# EAGLE design ECG_max86150_v1.7 (EAGLE 9.5.2)
ECG
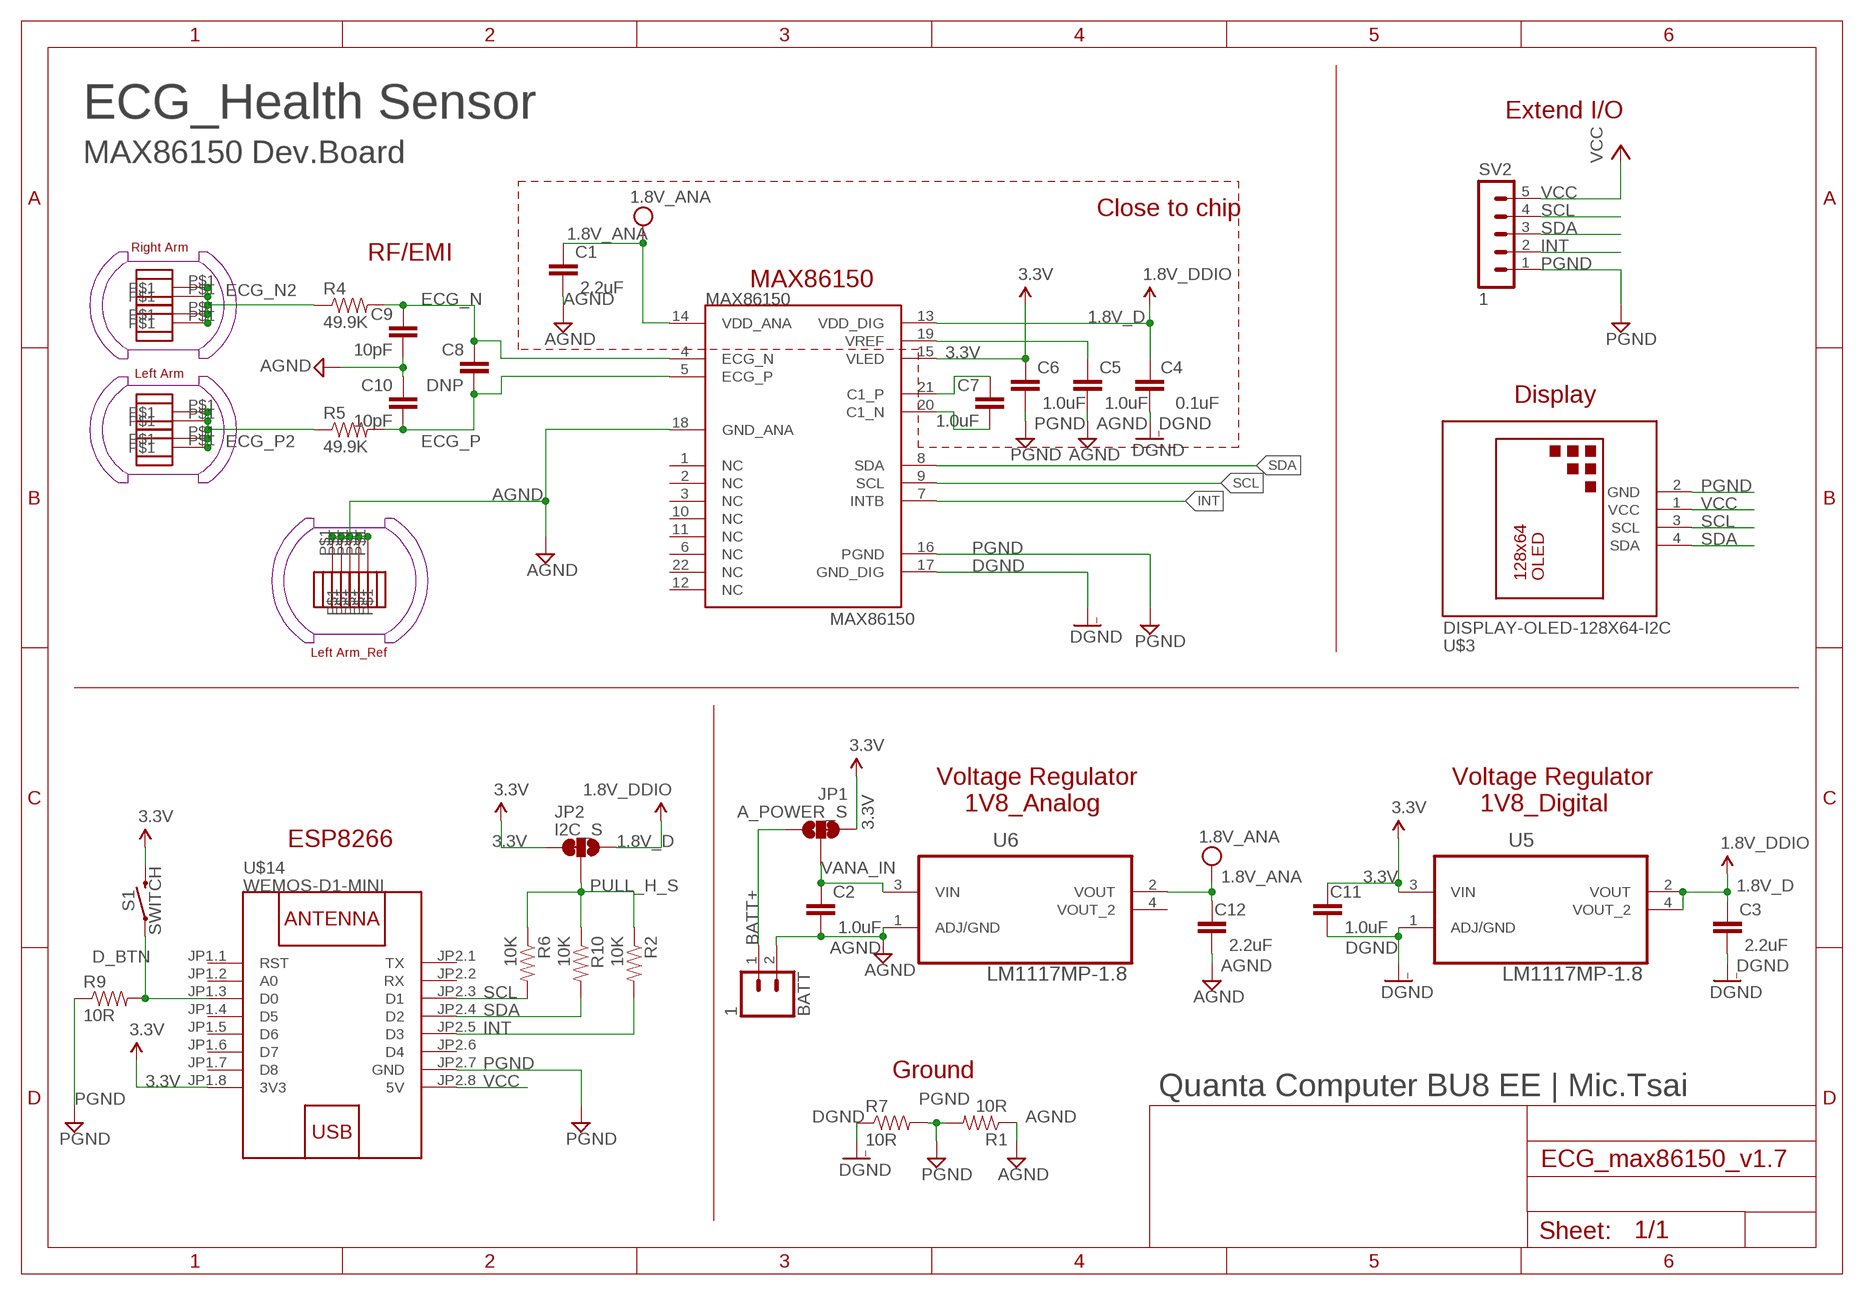
[diagram p0: schematic, sheet 1]

## Parts
BATT  1  CONN_02  [1X02]
C1  2.2uF  1.0UF-0805-25V-10%  [0805]
C2  1.0uF  1.0UF-0805-25V-10%  [0805]
C3  2.2uF  1.0UF-0805-25V-10%  [0805]
C4  0.1uF  1.0UF-0402-16V-10%  [0402]
C5  1.0uF  1.0UF-0805-25V-10%  [0805]
C6  1.0uF  1.0UF-0805-25V-10%  [0805]
C7  1.0uF  1.0UF-0805-25V-10%  [0805]
C8  DNP  1.0UF-0402-16V-10%  [0402]
C9  10pF  1.0UF-0402-16V-10%  [0402]
C10  10pF  1.0UF-0402-16V-10%  [0402]
C11  1.0uF  1.0UF-0805-25V-10%  [0805]
C12  2.2uF  1.0UF-0805-25V-10%  [0805]
JP1  A_POWER_S  JUMPER-SMT_3_1-NC_TRACE_SILK  [SMT-JUMPER_3_1-NC_TRACE_SILK]
JP2  I2C_S  JUMPER-SMT_3_1-NC_TRACE_SILK  [SMT-JUMPER_3_1-NC_TRACE_SILK]
MAX86150  MAX86150  [MAX86150]
R1  10R  RESISTOR0805-RES  [0805]
R2  10K  RESISTOR0402-RES  [0402-RES]
R4  49.9K  RESISTOR0402-RES  [0402-RES]
R5  49.9K  RESISTOR0402-RES  [0402-RES]
R6  10K  RESISTOR0402-RES  [0402-RES]
R7  10R  RESISTOR0805-RES  [0805]
R9  10R  RESISTOR0805-RES  [0805]
R10  10K  RESISTOR0402-RES  [0402-RES]
S1  SWITCH  MOMENTARY-SWITCH-SPST-PTH-6.0MM  [TACTILE_SWITCH_PTH_6.0MM]
SV2  1  MA05-1  [MA05-1]
U5  LM1117MP-1.8  [SOT230P696X180-4N]
U6  LM1117MP-1.8  [SOT230P696X180-4N]
U$1  ECG_PAD  [ECG_PAD1]
U$3  DISPLAY-OLED-128X64-I2C  [DISPLAY-OLED-128X64-I2C]
U$4  ECG_PAD  [ECG_PAD1]
U$6  ECG_PAD  [ECG_PAD1]
U$7  ECG_PAD  [ECG_PAD1]
U$9  ECG_PAD  [ECG_PAD1]
U$10  ECG_PAD  [ECG_PAD1]
U$11  ECG_PAD  [ECG_PAD1]
U$12  ECG_PAD  [ECG_PAD1]
U$13  ECG_PAD  [ECG_PAD1]
U$14  WEMOS-D1-MINI  [WEMOS-D1-MINI]
U$15  ECG_PAD  [ECG_PAD1]
U$16  ECG_PAD  [ECG_PAD1]
U$17  ECG_PAD  [ECG_PAD1]
U$18  ECG_PAD  [ECG_PAD1]

## Nets
1.8V_ANA: C1.1 C12.1 MAX86150.14(VDD_ANA) U6.2(VOUT)
1.8V_D: C3.1 C4.1 JP2.1 MAX86150.13(VDD_DIG) U5.2(VOUT) U5.4(VOUT_2) ; supply symbol labelled 1.8V_DDIO
3.3V: C6.1 C11.1 JP1.3 JP2.3 MAX86150.15(VLED) S1.3 U5.3(VIN) U$14.JP1.8(3V3)
AGND: BATT.2 C1.2 C2.2 C5.2 C9.2 C10.1 C12.2 MAX86150.18(GND_ANA) R1.1 U6.1(ADJ/GND) U$12.P$1 U$13.P$1 U$15.P$1 U$17.P$1 U$18.P$1
BATT+: BATT.1 JP1.1
D_BTN: R9.2 S1.1 U$14.JP1.3(D0)
DGND: C3.2 C4.2 C11.2 MAX86150.17(GND_DIG) R7.1 U5.1(ADJ/GND)
ECG_N: C8.1 C9.1 MAX86150.4(ECG_N) R4.2
ECG_N2: R4.1 U$9.P$1 U$10.P$1 U$11.P$1 U$16.P$1
ECG_P: C8.2 C10.2 MAX86150.5(ECG_P) R5.2
ECG_P2: R5.1 U$1.P$1 U$4.P$1 U$6.P$1 U$7.P$1
INT: MAX86150.7(INTB) R2.2 SV2.2 U$14.JP2.5(D3)
N$1: C7.1 MAX86150.21(C1_P)
N$2: C7.2 MAX86150.20(C1_N)
N$4: C5.1 MAX86150.19(VREF)
PGND: C6.2 MAX86150.16(PGND) R1.2 R7.2 R9.1 SV2.1 U$3.2(GND) U$14.JP2.7(GND)
PULL_H_S: JP2.2 R2.1 R6.1 R10.1
SCL: MAX86150.9(SCL) R6.2 SV2.4 U$3.3(SCL) U$14.JP2.3(D1)
SDA: MAX86150.8(SDA) R10.2 SV2.3 U$3.4(SDA) U$14.JP2.4(D2)
VANA_IN: C2.1 JP1.2 U6.3(VIN)
VCC: SV2.5 U$3.1(VCC) U$14.JP2.8(5V)
Unconnected: MAX86150.1(NC) MAX86150.2(NC) MAX86150.3(NC) MAX86150.6(NC) MAX86150.10(NC) MAX86150.11(NC) MAX86150.12(NC) MAX86150.22(NC) U6.4(VOUT_2) U$14.JP1.1(RST) U$14.JP1.2(A0) U$14.JP1.4(D5) U$14.JP1.5(D6) U$14.JP1.6(D7) U$14.JP1.7(D8) U$14.JP2.1(TX) U$14.JP2.2(RX) U$14.JP2.6(D4)

## Notes on the sheet
- ECG_Health Sensor | Extend I/O
- MAX86150 Dev.Board
- Close to chip
- Right Arm
- RF/EMI
- MAX86150
- Left Arm
- Display
- Left Arm_Ref
- Voltage Regulator
      1V8_Analog
- Voltage Regulator
      1V8_Digital
- ESP8266
- Ground
- Quanta Computer BU8 EE | Mic.Tsai

## Library data of the parts
BATT = SparkFun-Connectors:CONN_02: Multi connection point. Often used as Generic Header-pin footprint for 0.1 inch spaced/style header connections On any of the 0.1 inch spaced packages, you can populate with these: Break Away Headers - Straight <https://www.sparkfun.com/products/116> (PRT-00116) Break Away Male Headers - Right Angle <https://www.sparkfun.com/products/553> (PRT-00553) Female Headers <https://www.sparkfun.com/products/115> (PRT-00115) Break Away Headers - Machine Pin <https://www.sparkfun.com/products/117> (PRT-00117) Break Away Female Headers - Swiss Machine Pin <https://www.sparkfun.com/products/743> (PRT-00743) For SCREWTERMINALS and SPRING TERMINALS visit here: Screw Terimnals on SparkFun.com <https://www.sparkfun.com/search/results?term=Screw+Terminals> (5mm/3.5mm/2.54mm spacing) This device is also useful as a general connection point to wire up your design to another part of your project. Our various solder wires solder well into these plated through hole pads. Hook-Up Wire - Assortment (Stranded, 22 AWG) <https://www.sparkfun.com/products/11375> (PRT-11375) Hook-Up Wire - Assortment (Solid Core, 22 AWG) <https://www.sparkfun.com/products/11367> (PRT-11367) View the entire wire category on our website here <https://www.sparkfun.com/categories/141> Special notes: Molex polarized connector foot print use with: PRT-08233 with associated crimp pins and housings. 2.54_SCREWTERM for use with PRT-10571. 3.5mm Screw Terminal footprints for PRT-08084 5mm Screw Terminal footprints for use with PRT-08432
C1 C3 C12 = SparkFun-Capacitors:1.0UF: 1µF ceramic capacitors A capacitor is a passive two-terminal electrical component used to store electrical energy temporarily in an electric field.; PROD_ID: CAP-08064; VALUE: 1.0uF
C2 C5-C7 C11 = SparkFun-Capacitors:1.0UF: 1µF ceramic capacitors A capacitor is a passive two-terminal electrical component used to store electrical energy temporarily in an electric field.; PROD_ID: CAP-08064
C4 C8-C10 = SparkFun-Capacitors:1.0UF: 1µF ceramic capacitors A capacitor is a passive two-terminal electrical component used to store electrical energy temporarily in an electric field.; PROD_ID: CAP-12417; VALUE: 1.0uF
JP1 JP2 = SparkFun-Jumpers_change:JUMPER-SMT_3_1-NC_TRACE: Normally closed trace jumper (1 of 2 connections) This jumper has a trace between two pads so it's normally closed (NC). The other connection is normally open (NO). Use a razor knife to open the connection. For best results follow the IPC guidelines for cutting traces: Cutout at least 0.063 mm (0.005 in). Remove all loose material to clean up the cut area. Seal the cut with an approved epoxy. Reapply solder to reclose the connection, or to close the NO connection.
MAX86150 = circuitects:MAX86150
R1 R2 R4-R7 R9 R10 = SparkFun:RESISTOR: Resistor Basic schematic elements and footprints for 0603, 1206, and PTH resistors.
S1 = SparkFun-Switches:MOMENTARY-SWITCH-SPST: Momentary Switch (Pushbutton) - SPST Normally-open (NO) SPST momentary switches (buttons, pushbuttons). Variants PTH-12MM - 12mm square, through-hole Momentary Pushbutton Switch - 12mm Square <https://www.sparkfun.com/products/9190> (COM-09190) PTH-6.0MM, PTH-6.0MM-KIT - 6.0mm square, through-hole Mini Pushbutton Switch <https://www.sparkfun.com/products/97> (COM-00097) KIT package intended for soldering kit's - only one side of pads' copper is exposed. PTH-RIGHT-ANGLE-KIT - Right-angle, through-hole Right Angle Tactile Button <https://www.sparkfun.com/products/10791> - Used on SparkFun BigTime Watch Kit <https://www.sparkfun.com/products/11734> SMD-12MM - 12mm square, surface-mount Tactile Button - SMD (12mm) <https://www.sparkfun.com/products/12993> (COM-12993) Used on SparkFun PicoBoard <https://www.sparkfun.com/products/11888> SMD-4.5MM - 4.5mm Square Trackball Switch Used on SparkFun Blackberry Trackballer Breakout <https://www.sparkfun.com/products/13169> SMD-4.6MMX2.8MM - 4.60mm x 2.80mm, surface mount Used on SparkFun SAMD21 Mini Breakout <https://www.sparkfun.com/products/13664> SMD-5.2MM, SMD-5.2-REDUNDANT - 5.2mm square, surface-mount Mini Pushbutton Switch - SMD <https://www.sparkfun.com/products/8720> (COM-08720) Used on Arduino Pro Mini <https://www.sparkfun.com/products/11114> REDUNDANT package connects both switch circuits together SMD-6.0X3.5MM - 6.0 x 3.5mm, surface mount Momentary Reset Switch SMD <https://www.sparkfun.com/products/8229> (COM-08229) SMD-6.2MM-TALL - 6.2mm square, surface mount Tactile Button - SMD (6mm) <https://www.sparkfun.com/products/12992> Used on SparkFun Digital Sandbox <https://www.sparkfun.com/products/12651> SMD-RIGHT-ANGLE - Right-angle, surface mount Used on SparkFun Block for Intel® Edison - Arduino <https://www.sparkfun.com/products/13036>; PROD_ID: SWCH-08441; SF_SKU: COM-00097
SV2 = con-lstb:MA05-1: PIN HEADER; OC_FARNELL: unknown; OC_NEWARK: unknown
U5 U6 = LM1117MP-1.8:LM1117MP-1.8: IC REG LDO 800MA 1.8V; AVAILABILITY: Unavailable; DESCRIPTION: Linear Voltage Regulator IC 1 Output 800mA SOT-223; MF: Texas Instruments; MP: LM1117MP-1.8/NOPB; PACKAGE: SOT-223 Texas Instruments; PRICE: None
U$1 U$4 U$6 U$7 U$9-U$13 U$15-U$18 = circuitects:ECG_PAD
U$3 = diy-modules_oled change:DISPLAY-OLED-128X64-I2C: 128x64 Dot Matrix OLED Module based on SSD1306 chip Variant with I2C interface More details available here: http://www.instructables.com/id/Monochrome-096-i2c-OLED-display-with-arduino-SSD13/ SSD1306 datasheet: https://cdn-shop.adafruit.com/datasheets/SSD1306.pdf Click here to find device on ebay.com <http://www.ebay.com/sch/oled+display+128x64+iic> Note: There are two variants: I2C and SPI. Search for the proper version.
U$14 = diy-modules:WEMOS-D1-MINI: WEMOS D1 mini: Mini Wi-Fi Board based on ESP-8266 device More details can be found here: https://www.wemos.cc/product/d1-mini.html Click here to find device on ebay.com <http://www.ebay.com/sch/wemos+d1+mini+nodemcu>

## Board
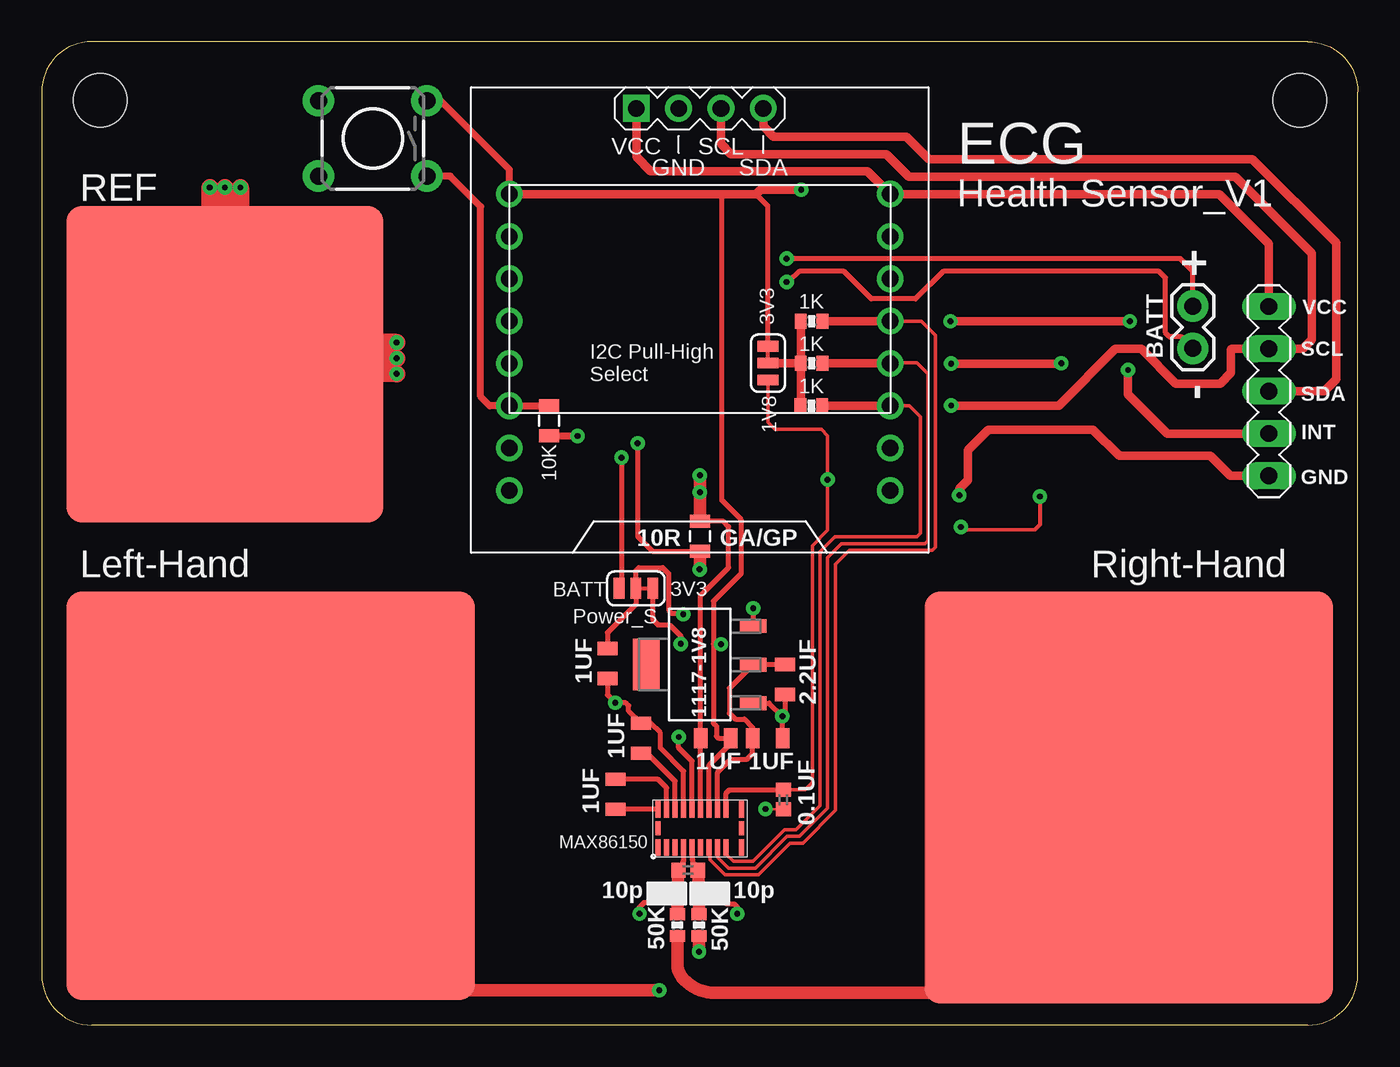
[diagram p1: board, top side]
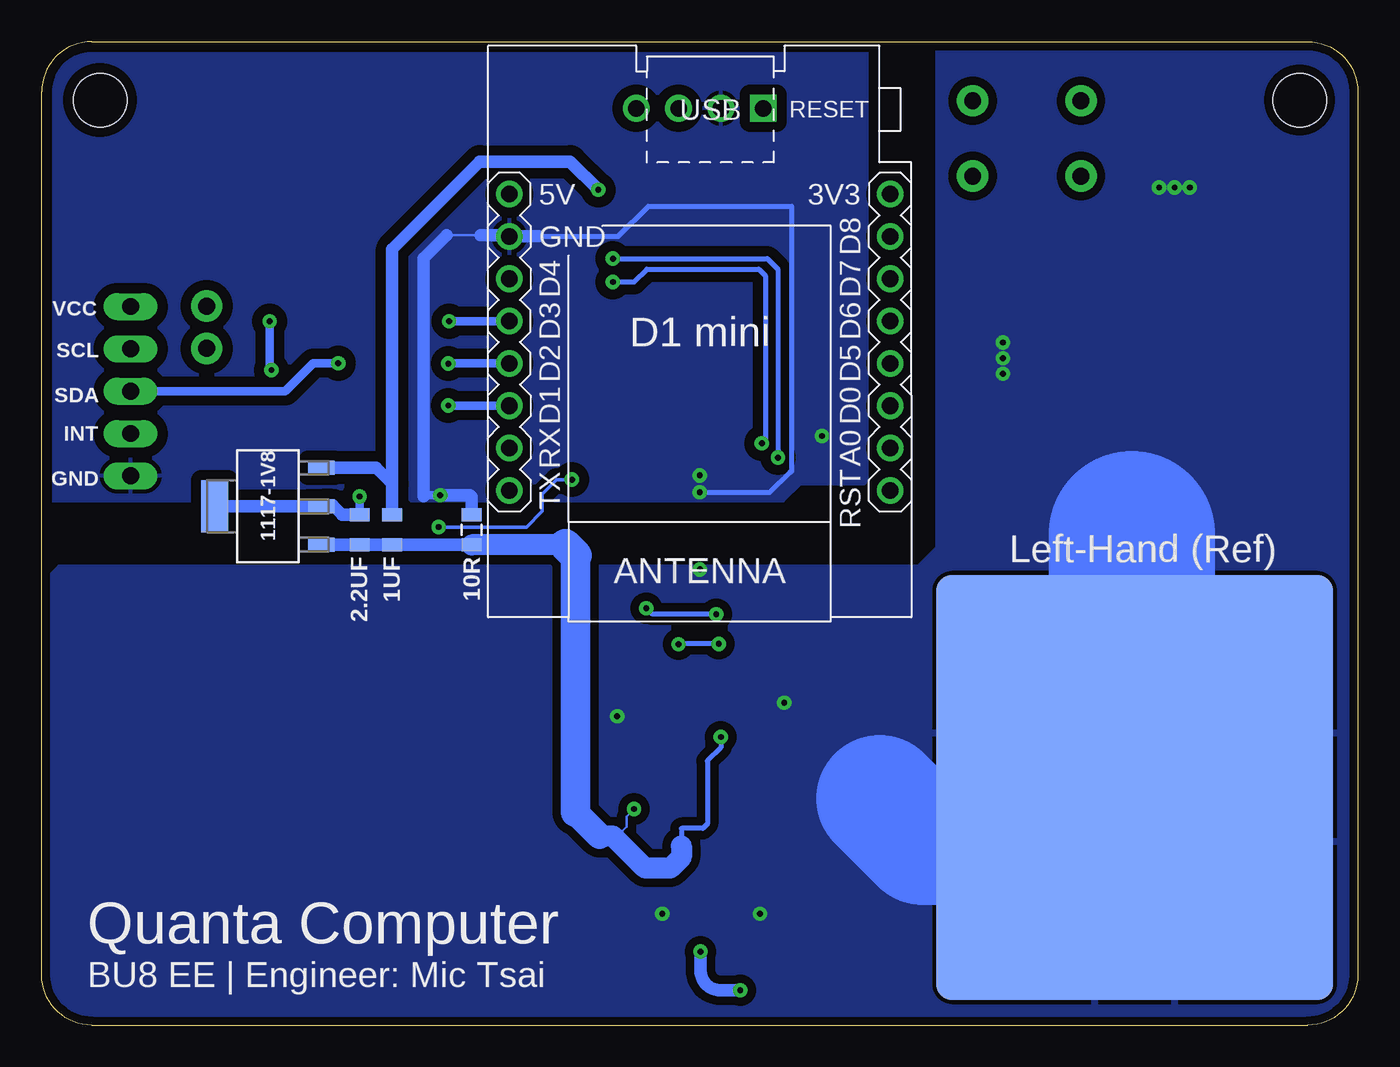
[diagram p2: board, bottom side, seen from below]

Size 79 x 59 mm. Coordinates in mm from the lower left corner, seen from the top.
Outline: 0,56 0,3 arc90 3,0 76,0 arc90 79,3 79,56 arc90 76,59 3,59 arc90 0,56
Copper layers (1*16): Top 0.035mm / dielectric 1.5mm / Bottom 0.035mm
Design rules "Circuitects-Rules *": minimum track width 6mil, minimum drill 0.3mm, track to track 8mil, track to pad 8mil, pad to pad 8mil, via to via 6mil, smd to smd 6mil, copper to edge 10mil, drill to drill 8mil, minimum pad ring 12mil, minimum via ring 10mil, stop-mask expansion 4mil, vias tented up to drill 25mil, thermal gap 10mil
Holes 3.2 mm at 3.5,55.5 75.5,55.5

### Footprints (pad centres in the part's own frame; a part is rotated, then mirrored left to right if it is on the bottom)
1X02 = drill 1.016 pad 1.88: 1 0,0; 2 2.54,0
0805 = smd 0.8 x 1.2: 1 -0.9,0; 2 0.9,0
0402 = smd 0.85 x 0.9: 1 -0.58,0; 2 0.58,0
SMT-JUMPER_3_1-NC_TRACE_SILK = smd 0.635 x 1.27: 1 -1.016,0; 2 0,0; 3 1.016,0
MAX86150 = smd 1 x 0.3: 1 -1.15,2.5; 2 -1.15,1.99; 3 -1.15,1.48; 4 -1.15,0.97; 5 -1.15,0.46; 6 -1.15,-0.05; 7 -1.15,-0.56; 8 -1.15,-1.07; 9 -1.15,-1.58; 10 -1.15,-2.5; 12 1.15,-2.5; 13 1.15,-1.58; 14 1.15,-1.07; 15 1.15,-0.56; 16 1.15,-0.05; 17 1.15,0.46; 18 1.15,0.97; 19 1.15,1.48; 20 1.15,1.99; 21 1.15,2.5 | smd 0.85 x 0.3: 11 0,-2.5; 22 0,2.5
0402-RES = smd 0.7 x 0.9: 1 -0.65,0; 2 0.65,0
TACTILE_SWITCH_PTH_6.0MM = drill 1.016 pad 1.88: 1 -3.251,2.261; 2 3.251,2.261; 3 -3.251,-2.261; 4 3.251,-2.261
MA05-1 = drill 1.016 long: 1 -5.08,0; 2 -2.54,0; 3 0,0; 4 2.54,0; 5 5.08,0
SOT230P696X180-4N = smd 1.6 x 0.838: 1 -3.2,2.311; 2 -3.2,0; 3 -3.2,-2.311 | smd 1.6 x 3.099: 4 3.2,0
ECG_PAD1 = smd 19 x 19: P$1 0,0
DISPLAY-OLED-128X64-I2C = drill 1 square: 1 -3.81,12.7 | drill 1: 2 -1.27,12.7; 3 1.27,12.7; 4 3.81,12.7
WEMOS-D1-MINI = drill 1: JP1.1 -11.43,9.525; JP1.2 -11.43,6.985; JP1.3 -11.43,4.445; JP1.4 -11.43,1.905; JP1.5 -11.43,-0.635; JP1.6 -11.43,-3.175; JP1.7 -11.43,-5.715; JP1.8 -11.43,-8.255; JP2.1 11.43,9.525; JP2.2 11.43,6.985; JP2.3 11.43,4.445; JP2.4 11.43,1.905; JP2.5 11.43,-0.635; JP2.6 11.43,-3.175; JP2.7 11.43,-5.715; JP2.8 11.43,-8.255

### Placement (x,y rotation side)
BATT  69.1,43.14 270 top
C1  43.57,17.21 0 top
C2  33.96,21.7 270 top
C3  59.93,29.71 270 bottom
C4  44.52,13.53 270 top
C5  35.96,17.21 90 top
C6  40.46,17.21 180 top
C7  34.43,13.84 90 top
C8  38.8,9.3 0 top
C9  37.6,7.9 180 top
C10  40,7.9 180 top
C11  57.96,29.71 270 bottom
C12  44.62,20.72 270 top
JP1  35.67,26.2 0 top
JP2  43.59,39.71 90 top
MAX86150  39.5,11.8 90 top
R1  39.5,29.32 90 top
R2  46.22,42.23 0 top
R4  38.15,6 90 top
R5  39.45,6 90 top
R6  46.2,37.16 0 top
R7  53.19,29.71 90 bottom
R9  30.46,36.25 90 top
R10  46.22,39.7 0 top
S1  19.87,53.2 180 top
SV2  73.66,38.03 90 top
U5  65.42,31.13 180 bottom
U6  39.5,21.63 180 top
U$1  16.5,11 0 top
U$3  39.5,42.3 0 top
U$4  16.5,16.5 0 top
U$6  11,11 0 top
U$7  11,16.5 0 top
U$9  68,10.8 0 top
U$10  68,16.5 0 top
U$11  62.5,10.8 0 top
U$12  11,11 0 bottom
U$13  15.8,11 0 bottom
U$14  39.5,41.6 180 bottom
U$15  15.8,17.5 0 bottom
U$16  62.5,16.5 0 top
U$17  11,17.5 0 bottom
U$18  11,39.64 0 top

### Tracks (layer width: path | path; a pad name or v marks a point on that pad's centre or on a via)
1.8V_ANA
  Top 0.305: MAX86150.14 40.57,15.17 41.36,15.96 42.35,15.96 42.67,16.28 C1.1 42.67,17.85 42.17,18.35 41.64,18.35 41.28,18.7 41.28,20.21 U6.2 C12.1
1.8V_D  (via drill 0.35)
  Top 0.203: C4.1 45.81,14.11 46.26,14.56 46.26,28.76 47.17,29.68 v47.17,32.72 47.17,35.37 46.8,35.75 44,35.75 43.59,36.15 JP2.1 | v55.18,29.88 55.33,29.73 59.62,29.73
  Top 0.254: v59.92,31.72 59.92,30.02 59.62,29.73
  Top 0.305: MAX86150.13 41.08,13.91 41.27,14.11 C4.1
  Bottom 0.203: v55.18,29.88 49.89,29.88 48.95,30.82 48.95,31.86 48.09,32.72 v47.17,32.72
  Bottom 0.508: C3.1 59.92,30.62 v59.92,31.72
  Bottom 0.762: C3.1 60.97,30.61 61.53,31.17 62.17,31.17 U5.2 U5.4
3.3V  (via drill 0.35)
  Top 0.203: 43.59,49.14 43.57,49.17
  Top 0.305: MAX86150.15 40.06,15.59 41.36,16.89 C6.1 40.62,17.21 40.5,17.33 40.5,17.94 40.32,18.12 40.32,22.87 | 43.57,49.17 42.88,49.85 | JP2.3 43.59,49.14 | 40.32,22.87 40.32,25.43 41.99,27.1 41.99,30.31 40.83,31.48 40.83,49.85 | v38.36,22.87 38.36,23.32 37.68,24.01 36.99,24.01 36.69,24.32 JP1.3 | v40.77,22.84 40.34,22.84 40.32,22.87
  Top 0.406: S1.3 23.93,55.46 28.07,51.32 U$14.JP1.8
  Top 0.508: U$14.JP1.8 40.83,49.85 42.88,49.85 43.14,50.11 v45.59,50.11
  Bottom 0.305: v38.36,22.87 40.75,22.87 v40.77,22.84
  Bottom 0.762: C11.1 57.96,32.47 | U5.3 58.93,33.44 57.96,32.47 | 57.96,32.47 57.96,46.54 52.7,51.8 47.28,51.8 v45.59,50.11
AGND  (via drill 0.35)
  Top 0.152: v39.5,27.35 v39.49,27.34 | 13.27,39.63 13.27,40.83 | 13.27,39.63 13.27,36.18 | 6.21,36.18 2.92,39.47 2.92,40.85 | 13.27,39.63 12.61,39.63 11.48,40.76 10.02,39.3 10.02,36.76 12.04,36.76 13.87,38.59 13.87,40.23 | U$18.P$1 7.72,42.93 7.72,44.78 | U$18.P$1 7.74,42.91 7.6,42.91 | U$18.P$1 10.42,40.22 10.42,48.27 | U$18.P$1 8.28,42.36 8.28,46.22 | U$18.P$1 10.09,40.55 10.09,48.8
  Top 0.305: C5.2 35.7,18.11 | MAX86150.18 38.53,15.23 37.13,16.63 37.13,17.53 36.55,18.11 C5.2 | BATT.2 68.41,41.28 67.7,41.28 67.44,41.54 67.44,44.84 67.06,45.22 54.11,45.22 52.46,43.57 49.79,43.57 48.14,45.22 45.47,45.22 44.84,44.59 v44.71,44.59 | v35.77,34.91 35.77,29.32 36.67,28.43 R1.1 | C9.2 36.47,7.35 36.15,7.35 35.88,7.08 v35.88,6.68 | C10.1 40.58,7.8 41.1,7.27 41.56,7.27 41.75,7.09 v41.75,6.68 | C5.2 35.24,18.84 35.24,19.16 35.07,19.33 v34.43,19.33 33.95,19.81 C2.2 | C1.2 44.47,18.51 | 44.47,18.51 v44.46,18.52 43.67,19.32 U6.1 | C12.2 44.62,18.66 44.47,18.51
  Top 0.762: R1.1 v39.5,27.35
  Top 1.016: 10.42,48.27 10.36,48.2 | v21.31,40.95 19.39,40.95 | v21.31,40 19.58,40 19.54,39.96 | v21.31,39.07 19.82,39.07 19.77,39.12 | v10.09,50.25 10.09,48.8 10.02,48.73 | v11,50.25 11,48.12 11.01,48.12 | v11.93,50.25 11.93,48.43 11.92,48.42
  Top 1.27: 12.16,43.53 6.98,43.53 7.6,42.91 9.12,41.39 9.12,41.28 6.52,43.87 7.42,44.78 | 7.72,44.78 7.42,44.78 | 5.91,43.58 7.11,44.78 7.42,44.78 | 2.92,40.85 8.28,46.22 9.28,47.21 | 13.27,40.83 11.53,40.2 11.2,40.2 U$18.P$1 11,41.59 8.52,44.08 7.63,43.19
  Bottom 0.152: U$12.P$1 U$13.P$1
  Bottom 0.305: v44.71,44.59 43.44,44.59 42.68,45.35 35.95,45.35 35.57,44.97 35.57,35.11 v35.77,34.91
  Bottom 1.27: U$17.P$1 U$15.P$1 | 15.8,14.59 15.8,12.89 16.09,12.61 16.52,13.04 16.52,16.78 U$15.P$1 | 15.8,14.59 U$15.P$1 | U$12.P$1 14.59,14.59 15.8,14.59 | U$15.P$1 U$13.P$1
  Bottom 10: U$15.P$1 13.56,19.73 13.56,29.45
  Bottom 7.62: U$13.P$1 26.11,11 28.71,13.6
  pour Top (isolate 7.62, rank 3): -0.5,59 -0.5,-0.5 79.5,-0.5 79.5,26.83 77.66,28.67 33.49,28.67 33.03,29.13 25.76,29.13 24.91,29.98 24.91,59
  pour Bottom (isolate 0.508): 0.5,58.5 0.5,0.5 78.5,0.5 78.5,26.84 77.9,27.44 26.31,27.44 25.13,28.62 25.13,58.5
BATT+  (via drill 0.35)
  Top 0.305: BATT.1 69.1,45.22 68.33,45.98 v44.71,45.98 | v34.81,34.04 34.81,26.35 JP1.1
  Bottom 0.305: v44.71,45.98 35.44,45.98 34.81,45.35 v34.81,34.04
D_BTN
  Top 0.406: S1.1 24.52,50.94 26.35,49.11 26.35,37.7 26.89,37.16 U$14.JP1.3 R9.2
DGND  (via drill 0.35)
  Top 0.152: C4.2 43.45,12.95 v43.44,12.96
  Top 0.305: MAX86150.17 39.04,15.84 38.23,16.64 v38.23,17.28
  Bottom 0.152: v43.44,12.96 43.9,12.51 43.9,11.89 44.59,11.21
  Bottom 0.305: v38.23,17.28 38.23,16.64 39.03,15.84 39.03,12.07 39.31,11.79 40.6,11.79 40.6,10.75
  Bottom 0.508: 53.3,28.6 R7.1
  Bottom 0.762: U5.1 C3.2 C11.2 53.51,28.81 53.3,28.6
  Bottom 1.27: 40.6,10.75 40.6,10.07 41.26,9.41 42.78,9.41 44.59,11.21 44.71,11.34 45.52,11.34 | 47.58,28.81 R7.1
  Bottom 1.524: 45.52,11.34 46.95,12.76
  Bottom 1.778: 46.95,12.76 46.95,28.18
  Bottom 1.905: 46.95,28.18 47.58,28.81
ECG_N
  Top 0.305: MAX86150.4 38.53,10.05 arc-45 C8.1
  Top 0.762: R4.2 38.15,7.87 C9.1 38.18,9.26 C8.1
  pour Top: 38.59,6.32 37.73,6.32 37.71,6.33
ECG_N2
  Top 0.152: 62.11,6.05 58.26,9.9 58.26,10.56 | U$16.P$1 62.5,7.13 58.68,3.31 | U$10.P$1 67.28,17.22 66.47,17.22
  Top 0.406: U$11.P$1 58.26,10.56 | 62.56,13.44 U$16.P$1 | 70,10.66 71.51,12.18 66.47,17.22 61.32,22.36 arc45 60.28,21.93 57.72,19.36 57.72,16.2 arc45 58.46,14.4 61.78,11.08
  Top 0.762: R4.1 38.15,3.71 arc45 38.56,2.71 arc45 40.43,1.94 57.31,1.94 58.68,3.31 | 62.11,6.05 70.36,14.3 70.36,14.34 68.14,16.56 68,16.41 U$9.P$1 69.86,10.8 70,10.66 | 61.78,11.08 62.56,11.86 62.56,13.44
ECG_P
  Top 0.305: MAX86150.5 39.04,10.12 arc45 C8.2
  Top 0.762: R5.2 39.45,7.87 C10.2 39.42,9.26 C8.2
ECG_P2  (via drill 0.35)
  Top 0.152: 20.86,10.64 20.86,16.77 20.52,16.77 | U$1.P$1 16.5,8.92 16.64,8.77 17.79,8.77 | 17.79,8.77 19.31,8.77 19.69,9.15 19.69,11.31 19.06,11.95 14.23,11.95 12.71,10.42 16.33,6.8 17.79,5.34 21.98,5.34 24.27,7.63 24.27,13.98 16.01,13.98 19.28,10.71 19.98,10.71 | 20.52,16.77 16.77,16.77 U$4.P$1 17.03,15.97 17.03,9.53 17.79,8.77 | 20.5,16.79 20.52,16.77
  Top 0.406: 19.98,10.71 20.86,10.64 | U$6.P$1 12.52,12.52 arc45 13.27,14.32 | 13.27,14.32 13.27,17.28 19.82,17.28 | U$7.P$1 12.62,15.88 arc-45 13.27,14.32
  Top 0.762: 20.5,16.79 20.77,17.06 20.56,17.28 19.82,17.28 | R5.1 39.45,4.41 arc45 v39.45,4.4 | v37.07,2.09 15.45,2.09 13.98,3.56 13.98,4.45 16.33,6.8 12.13,11 U$6.P$1
  Bottom 0.762: v39.45,4.4 39.45,3.26 arc-90 38.29,2.09 v37.07,2.09
INT  (via drill 0.35)
  Top 0.203: MAX86150.7 40.11,10.6 40.11,9.92 41.02,9.01 43.02,9.01 44.91,10.9 45.68,10.9 47.66,12.88 47.66,27.65 48.49,28.48 53.47,28.48 53.65,28.66 53.65,41.37 52.8,42.23 U$14.JP2.5
  Top 0.508: R2.2 U$14.JP2.5 | v54.54,42.22 v65.31,42.22 | v65.21,39.3 65.21,37.85 67.57,35.49 SV2.2
  Bottom 0.508: U$14.JP2.5 54.53,42.23 v54.54,42.22 | v65.31,42.22 65.31,39.4 v65.21,39.3
N$1
  Top 0.305: MAX86150.21 C7.1
N$2
  Top 0.305: MAX86150.20 37.51,14.23 37,14.74 C7.2
N$4
  Top 0.305: MAX86150.19 38.02,14.64 36.35,16.31 C5.1
NO3
  cutout Top: 38.01,2.85 38.82,2.83 38.01,2.83
PGND  (via drill 0.35)
  Top 0.305: MAX86150.16 C6.2 39.56,25.77 41.23,27.44 41.23,29.9 40.91,30.23 R1.2
  Top 0.406: R9.1 32.15,35.35 v32.16,35.34
  Top 0.508: SV2.1 71.33,32.95 70.14,34.15 64.68,34.15 63.1,35.72 56.83,35.72 55.58,34.48 55.58,32.67 55.08,32.16 v55.08,31.78
  Top 0.762: R1.2 v39.51,31.96 v39.51,32.98
  Bottom 0.152: 52.66,47.38 54.69,47.38
  Bottom 0.305: U$14.JP2.7 44.4,47.31 42.58,49.13 33.97,49.13 33.97,33.21 34.07,33.21 35.31,31.96 v39.51,31.96
  Bottom 0.508: v55.08,31.78 56.04,31.78 56.09,31.74
  Bottom 0.762: 56.09,31.74 56.08,31.74 56.08,45.99 54.69,47.38 | 52.66,47.38 50.99,47.38 U$14.JP2.7 49.17,47.31 | R7.2 53.19,31.7 53.27,31.78 v55.08,31.78
  pour Bottom (isolate 0.61): 29.48,58.43 29.48,32.65 29.65,32.48 33.5,32.48 34.53,31.45 78.62,31.45 78.62,56.98 77.18,58.43
PULL_H_S
  Top 0.508: R2.1 R10.1 | R10.1 45.57,37.17 R6.1 | JP2.2 R10.1
SCL  (via drill 0.35)
  Top 0.203: MAX86150.9 41.08,10.26 41.51,9.82 42.68,9.82 44.57,11.72 45.27,11.72 46.72,13.16 46.72,28.39 47.62,29.29 52.52,29.29 52.74,29.51 52.74,36.49 52.08,37.16 U$14.JP2.3
  Top 0.508: R6.2 U$14.JP2.3 | v54.59,37.17 61.04,37.17 64.44,40.57 66,40.57 68.08,38.49 70.75,38.49 71.38,39.12 71.38,40.52 71.43,40.57 SV2.4 75.7,40.57 76.23,41.1 76.23,46.31 71.64,50.91 52.05,50.91 50.71,52.26 41.38,52.26 40.77,52.87 U$3.3
  Bottom 0.508: U$14.JP2.3 54.58,37.16 v54.59,37.17
SDA  (via drill 0.35)
  Top 0.152: MAX86150.8 40.57,10.6
  Top 0.203: 40.57,10.6 40.57,10.06 41.22,9.42 42.85,9.42 44.74,11.31 45.49,11.31 47.18,13 47.18,28.05 48.02,28.89 53.02,28.89 53.2,29.06 53.2,39.09 52.55,39.73 50.96,39.73 U$14.JP2.4
  Top 0.508: R10.2 U$14.JP2.4 | v54.59,39.68 61.17,39.68 v61.2,39.71 | U$3.4 43.31,53.91 43.92,53.3 51.9,53.3 53.25,51.95 72.68,51.95 77.71,46.92 77.71,38.74 76.99,38.03 SV2.3
  Bottom 0.508: U$14.JP2.4 54.58,39.7 v54.59,39.68 | v61.2,39.71 62.7,39.71 64.37,38.03 SV2.3
VANA_IN  (via drill 0.35)
  Top 0.305: C2.1 33.95,23.54 35.67,25.26 JP1.2 35.67,27.26 35.85,27.44 37.27,27.44 37.62,27.08 37.62,24.9 37.83,24.7 38.46,24.7 v38.51,24.65 | U6.3 42.68,23.96 42.7,23.99 v42.7,25
  Bottom 0.305: v38.51,24.65 42.35,24.65 v42.7,25
VCC
  Top 0.508: SV2.5 73.67,46.87 70.68,49.85 U$14.JP2.8 49.57,51.21 36.56,51.21 35.69,52.08 U$3.1

### Text on the board
tPlace: ECG | REF | Health Sensor_V1 | 3V3 | + | 1K | VCC | 1K | SCL | I2C Pull-High / Select | 1V8 | 1K | - | SDA | INT | 10K | GND | 10R | GA/GP | Left-Hand | Right-Hand | BATT | 3V3 | Power_S | 2.2UF | 1UF | 1117-1V8 | 1UF | 1UF | 1UF | 0.1UF | 1UF | MAX86150 | 10p | 50K | 10p | 50K
bPlace: VCC | SCL | SDA | INT | 1117-1V8 | GND | 10R | 1UF | 2.2UF | Left-Hand (Ref) | Quanta Computer | BU8 EE | Engineer: Mic Tsai